# EAGLE schematic design_picodrone (EAGLE 9.6.2)
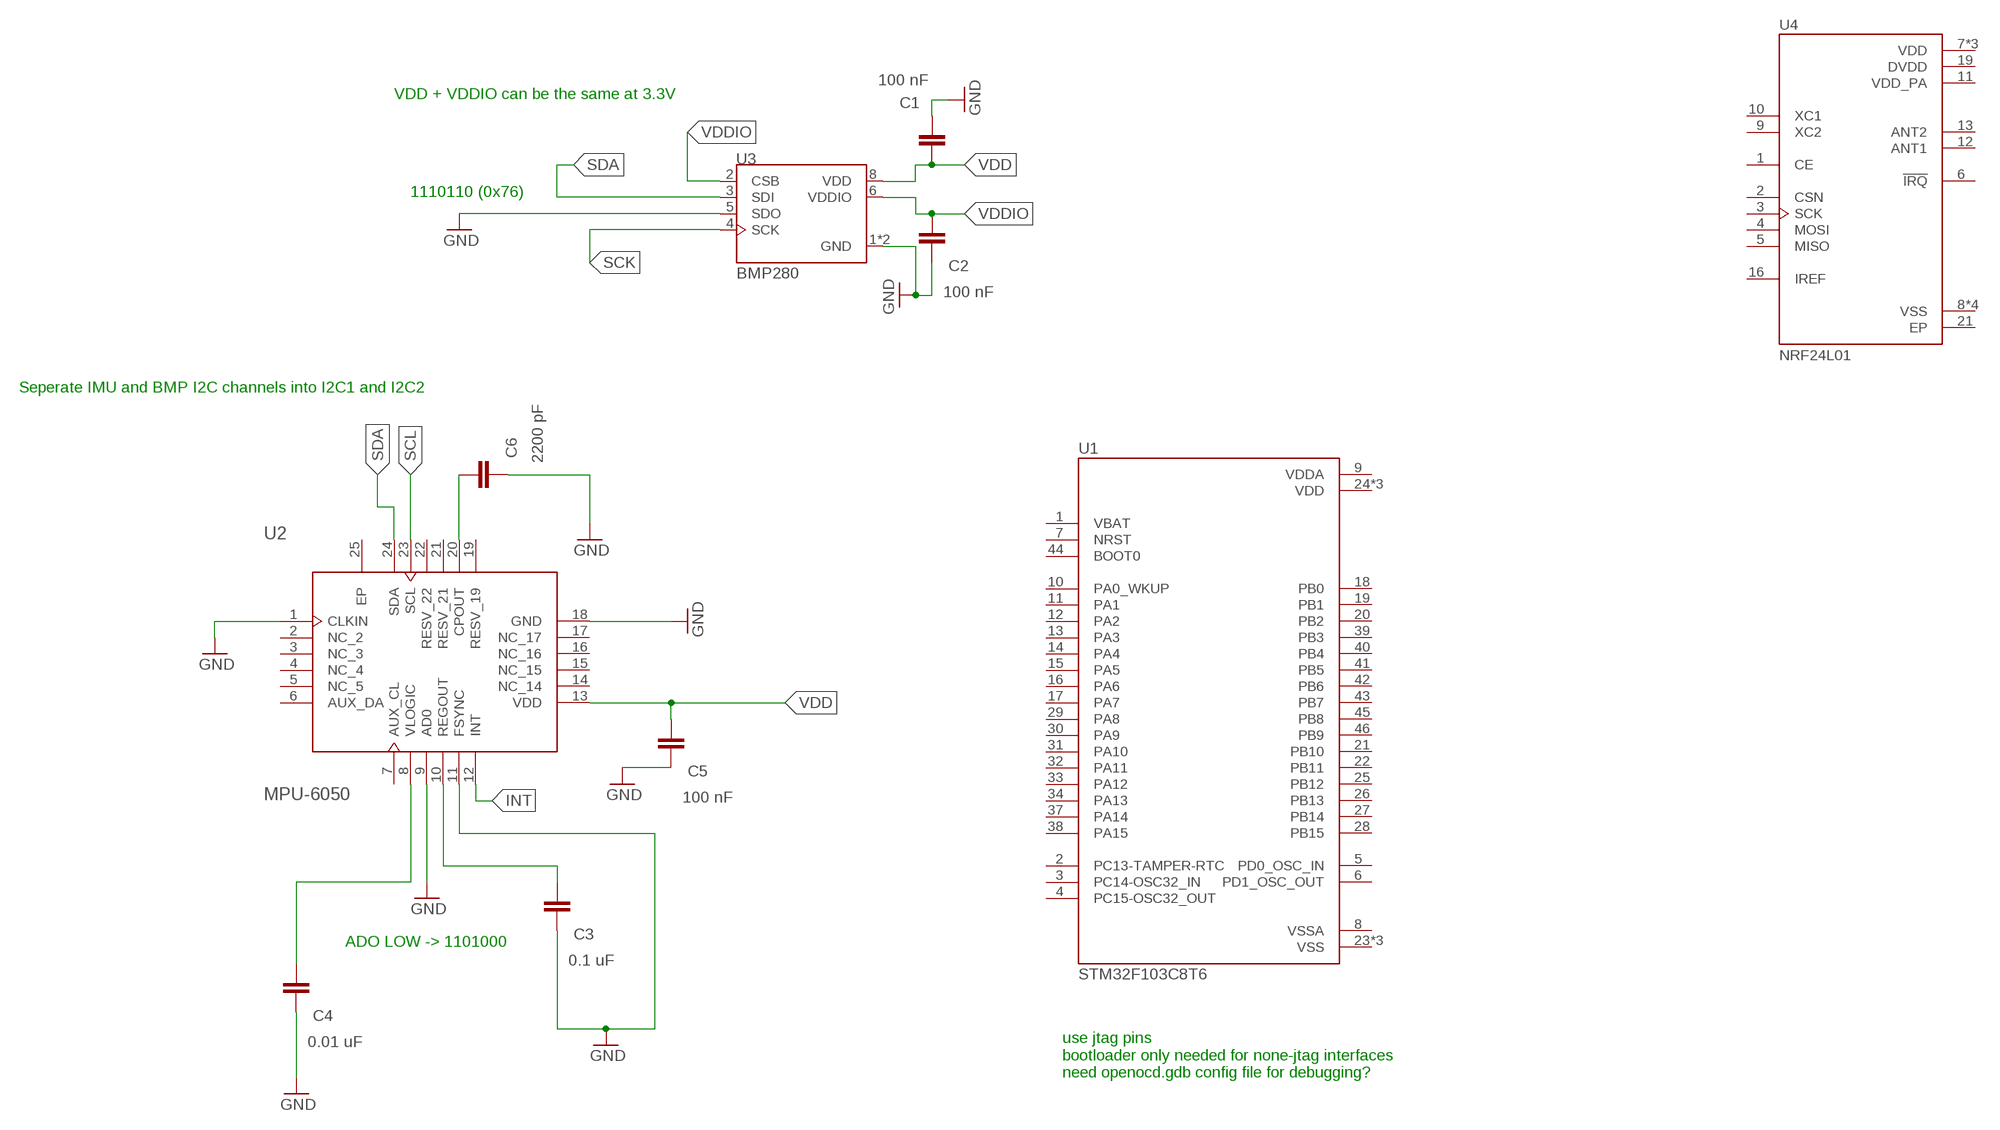
[diagram p0: schematic, sheet 1]

## Parts
C1  100 nF  C0603C100C5GACTU  [CAP_0603]
C2  100 nF  C0603C100C5GACTU  [CAP_0603]
C3  0.1 uF  C0603C100C5GACTU  [CAP_0603]
C4  0.01 uF  C0603C100C5GACTU  [CAP_0603]
C5  100 nF  C0603C100C5GACTU  [CAP_0603]
C6  2200 pF  C0603C100C5GACTU  [CAP_0603]
U1  STM32F103C8T6  [QFP50P900X900X160-48N]
U2  MPU-6050  [24-VFQFN]
U3  BMP280  [XDCR_BMP280]
U4  NRF24L01  [QFN50P400X400X95-21N]

## Nets
GND: C1.1 C2.2 C3.2 C4.2 C5.2 C6.2 U2.1(CLKIN) U2.9(AD0) U2.11(FSYNC) U2.18(GND) U3.1(GND) U3.5(SDO) U3.7(GND)
INT: U2.12(INT)
N$1: C4.1 U2.8(VLOGIC)
N$2: C3.1 U2.10(REGOUT)
N$3: C6.1 U2.20(CPOUT)
SCK: U3.4(SCK)
SCL: U2.23(SCL)
SDA: U2.24(SDA) U3.3(SDI)
VDD: C1.2 C5.1 U2.13(VDD) U3.8(VDD)
VDDIO: C2.1 U3.2(CSB) U3.6(VDDIO)
Unconnected: U1.1(VBAT) U1.2(PC13-TAMPER-RTC) U1.3(PC14-OSC32_IN) U1.4(PC15-OSC32_OUT) U1.5(PD0_OSC_IN) U1.6(PD1_OSC_OUT) U1.7(NRST) U1.10(PA0_WKUP) U1.11(PA1) U1.12(PA2) U1.13(PA3) U1.14(PA4) U1.15(PA5) U1.16(PA6) U1.17(PA7) U1.18(PB0) U1.19(PB1) U1.20(PB2) U1.21(PB10) U1.22(PB11) U1.25(PB12) U1.26(PB13) U1.27(PB14) U1.28(PB15) U1.29(PA8) U1.30(PA9) U1.31(PA10) U1.32(PA11) U1.33(PA12) U1.34(PA13) U1.37(PA14) U1.38(PA15) U1.39(PB3) U1.40(PB4) U1.41(PB5) U1.42(PB6) U1.43(PB7) U1.44(BOOT0) U1.45(PB8) U1.46(PB9) U2.2(NC_2) U2.3(NC_3) U2.4(NC_4) U2.5(NC_5) U2.6(AUX_DA) U2.7(AUX_CL) U2.14(NC_14) U2.15(NC_15) U2.16(NC_16) U2.17(NC_17) U2.19(RESV_19) U2.21(RESV_21) U2.22(RESV_22) U4.1(CE) U4.2(CSN) U4.3(SCK) U4.4(MOSI) U4.5(MISO) U4.6(!IRQ) U4.9(XC2) U4.10(XC1) U4.12(ANT1) U4.13(ANT2) U4.16(IREF)

## Notes on the sheet
- VDD + VDDIO can be the same at 3.3V
- 1110110 (0x76)
- Seperate IMU and BMP I2C channels into I2C1 and I2C2
- ADO LOW -> 1101000
- use jtag pins
  bootloader only needed for none-jtag interfaces
  need openocd.gdb config file for debugging?

## Power pins joined to a net without a drawn wire
DVDD: U4.19(DVDD)
EP: U2.25(EP) U4.21(EP)
VDD: U1.24(VDD) U1.36(VDD) U1.48(VDD) U4.7(VDD) U4.15(VDD) U4.18(VDD)
VDD_PA: U4.11(VDD_PA)
VDDA: U1.9(VDDA)
VSS: U1.23(VSS) U1.35(VSS) U1.47(VSS) U4.8(VSS) U4.14(VSS) U4.17(VSS) U4.20(VSS)
VSSA: U1.8(VSSA)

## Library data of the parts
C1-C6 = Resistor_Capacitor:C0603C100C5GACTU: CAP CER 10PF 50V C0G/NP0 0603 Manufacturer's datasheet <https://content.kemet.com/datasheets/KEM_C1003_C0G_SMD.pdf>; CREATED_BY: PCBLayout.com; DIGIKEY_PART_NUMBER: 399-7814-2-ND; MANUFACTURER: KEMET; MPN: C0603C100C5GACTU; PACKAGE: SMD 0603
U1 = STM32F103C8T6:STM32F103C8T6: Mainstream Performance line, ARM Cortex-M3 MCU with 64 Kbytes Flash, 72 MHz CPU, motor control, USB and CAN Check prices <https://pricing.snapeda.com/parts/STM32F103C8T6/STMicroelectronics/view-part?ref=eda>; AVAILABILITY: Warning; DESCRIPTION: ARM® Cortex®-M3 STM32F1 Microcontroller IC 32-Bit 72MHz 64KB (64K x 8) FLASH 48-LQFP (7x7); MF: STMicroelectronics; MP: STM32F103C8T6; PACKAGE: LQFP-48 STMicroelectronics; PRICE: None; PURCHASE-URL: https://pricing.snapeda.com/search/part/STM32F103C8T6/?ref=eda
U2 = Sensor:MPU-6050: IMU ACCEL/GYRO 3-AXIS I2C 24QFN Manufacturer's datasheet <https://store.invensense.com/datasheets/invensense/MPU-6050_DataSheet_V3%204.pdf>; CREATED_BY: PCBLayout.com; DIGIKEY_PART_NUMBER: 1428-1007-1-ND; MANUFACTURER: TDK InvenSense; MPN: MPU-6050; PACKAGE: 24-VFQFN
U3 = BMP280:BMP280: BMP280 Absolute Barometric Pressure Sensor for Battery Powered Devices 2 x 2.5mm Check prices <https://pricing.snapeda.com/parts/BMP280/Bosch/view-part?ref=eda>; AVAILABILITY: Good; DESCRIPTION: Pressure Sensor 4.35PSI ~ 15.95PSI (30kPa ~ 110kPa) Absolute 16b 8-SMD; MF: Bosch; MP: BMP280; PACKAGE: SMD-8 Bosch Sensortec; PRICE: None; PURCHASE-URL: https://pricing.snapeda.com/search/part/BMP280/?ref=eda
U4 = NRF24L01:NRF24L01: The nRF24L01 is a single chip 2.4GHz transceiver with an embedded baseband protocol engine (Enhanced ShockBurst™), designed for ultra low power wireless applications. The nRF24L01 is designed for operation in the world wide ISM frequency band at 2.400 - 2.4835GHz. An MCU (microcontroller) and very few external passive components are needed to design a radio system with the nRF24L01. The nRF24L01 is configured and operated through a Serial Peripheral Interface (SPI.) Through this interface the register map is available. The register map contains all configuration registers in the nRF24L01 and is accessible in all operation modes of the chip. Check prices <https://pricing.snapeda.com/parts/NRF24L01/Nordic/view-part?ref=eda>; AVAILABILITY: Warning; DESCRIPTION: IC RF TxRx Only General ISM > 1GHZ 2.4GHz 20-VFQFN Exposed Pad; MF: Nordic; MP: NRF24L01; PACKAGE: VFQFN-20 Nordic Semiconductor; PRICE: None; PURCHASE-URL: https://pricing.snapeda.com/search/part/NRF24L01/?ref=eda